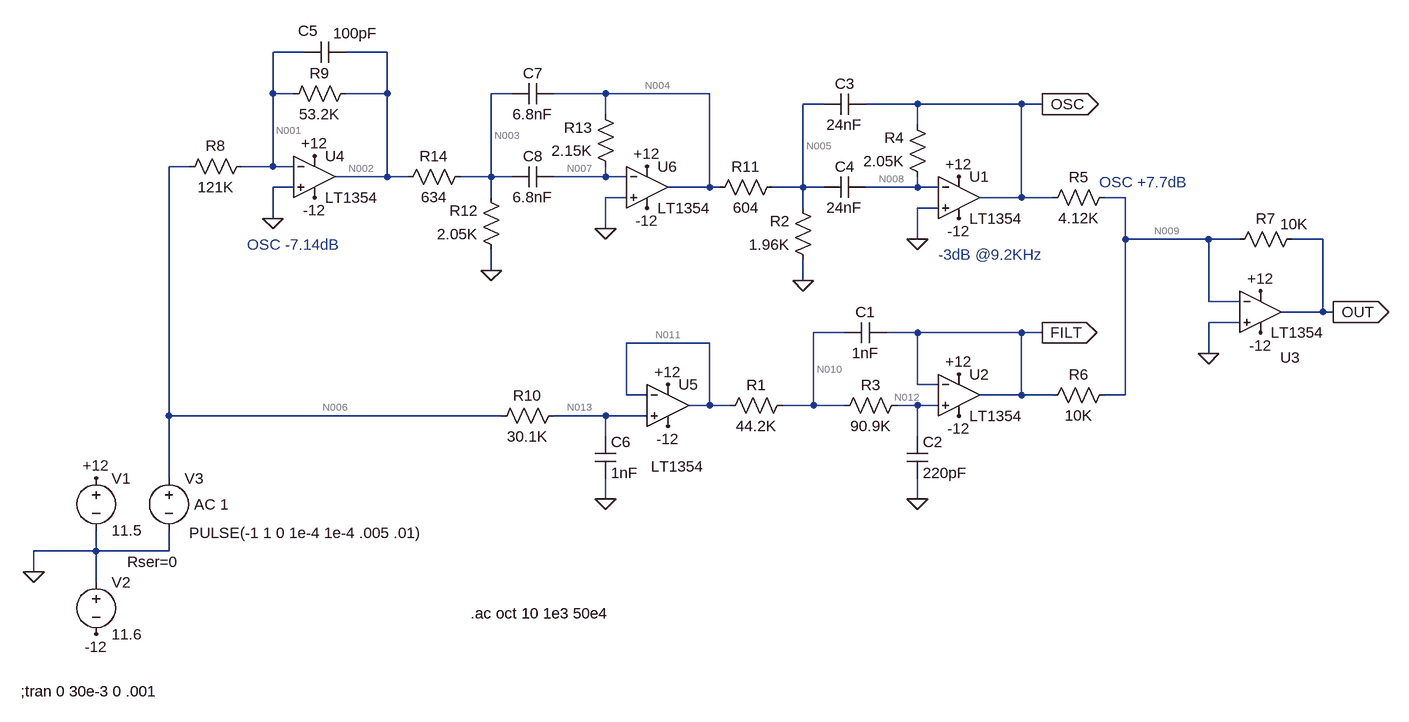
[diagram p0: schematic VCF model.asc]
VCF model.asc, the LTspice schematic file:
Version 4
SHEET 1 1956 680
WIRE -384 -544 -432 -544
WIRE -256 -544 -320 -544
WIRE -432 -480 -432 -544
WIRE -400 -480 -432 -480
WIRE -256 -480 -256 -544
WIRE -256 -480 -320 -480
WIRE -64 -480 -96 -480
WIRE 80 -480 0 -480
WIRE 240 -480 80 -480
WIRE 416 -464 384 -464
WIRE 560 -464 480 -464
WIRE 720 -464 560 -464
WIRE 752 -464 720 -464
WIRE 80 -448 80 -480
WIRE 560 -432 560 -464
WIRE -560 -368 -592 -368
WIRE -432 -368 -432 -480
WIRE -432 -368 -480 -368
WIRE -400 -368 -432 -368
WIRE -256 -352 -256 -480
WIRE -256 -352 -336 -352
WIRE -224 -352 -256 -352
WIRE -96 -352 -96 -480
WIRE -96 -352 -144 -352
WIRE -64 -352 -96 -352
WIRE 80 -352 80 -368
WIRE 80 -352 0 -352
WIRE 112 -352 80 -352
WIRE -400 -336 -432 -336
WIRE 240 -336 240 -480
WIRE 240 -336 176 -336
WIRE 256 -336 240 -336
WIRE 384 -336 384 -464
WIRE 384 -336 336 -336
WIRE 416 -336 384 -336
WIRE 560 -336 560 -352
WIRE 560 -336 480 -336
WIRE 592 -336 560 -336
WIRE -96 -320 -96 -352
WIRE 112 -320 80 -320
WIRE 720 -320 720 -464
WIRE 720 -320 656 -320
WIRE 768 -320 720 -320
WIRE 880 -320 848 -320
WIRE 384 -304 384 -336
WIRE 592 -304 560 -304
WIRE -432 -288 -432 -336
WIRE 80 -272 80 -320
WIRE 560 -256 560 -304
WIRE 880 -256 880 -320
WIRE 1008 -256 880 -256
WIRE 1056 -256 1008 -256
WIRE 1184 -256 1136 -256
WIRE -96 -208 -96 -240
WIRE 384 -192 384 -224
WIRE 1008 -160 1008 -256
WIRE 1056 -160 1008 -160
WIRE 1184 -144 1184 -256
WIRE 1184 -144 1120 -144
WIRE 1200 -144 1184 -144
WIRE 1056 -128 1008 -128
WIRE 448 -112 400 -112
WIRE 560 -112 512 -112
WIRE 720 -112 560 -112
WIRE 752 -112 720 -112
WIRE 240 -96 112 -96
WIRE 1008 -80 1008 -128
WIRE 560 -32 560 -112
WIRE 592 -32 560 -32
WIRE 112 -16 112 -96
WIRE 144 -16 112 -16
WIRE 720 -16 720 -112
WIRE 720 -16 656 -16
WIRE 768 -16 720 -16
WIRE 880 -16 880 -256
WIRE 880 -16 848 -16
WIRE 240 0 240 -96
WIRE 240 0 208 0
WIRE 272 0 240 0
WIRE 400 0 400 -112
WIRE 400 0 352 0
WIRE 448 0 400 0
WIRE 560 0 528 0
WIRE 592 0 560 0
WIRE -592 16 -592 -368
WIRE -80 16 -592 16
WIRE 80 16 0 16
WIRE 144 16 80 16
WIRE 80 48 80 16
WIRE 560 48 560 0
WIRE -592 112 -592 16
WIRE 80 144 80 112
WIRE 560 144 560 112
WIRE -704 224 -704 192
WIRE -704 224 -800 224
WIRE -592 224 -592 192
WIRE -592 224 -704 224
WIRE -800 256 -800 224
WIRE -704 272 -704 224
FLAG -800 256 0
FLAG -704 112 +12
FLAG -704 352 -12
FLAG 560 144 0
FLAG 624 -48 +12
FLAG 624 16 -12
FLAG 384 -192 0
FLAG 624 -352 +12
FLAG 624 -288 -12
FLAG 1008 -80 0
FLAG 1088 -176 +12
FLAG 1088 -112 -12
FLAG -368 -384 +12
FLAG -368 -320 -12
FLAG -432 -288 0
FLAG 752 -464 OSC
IOPIN 752 -464 Out
FLAG 752 -112 FILT
IOPIN 752 -112 Out
FLAG 1200 -144 OUT
IOPIN 1200 -144 Out
FLAG 176 -32 +12
FLAG 176 32 -12
FLAG 80 144 0
FLAG 560 -256 0
FLAG -96 -208 0
FLAG 144 -368 +12
FLAG 144 -304 -12
FLAG 80 -272 0
SYMBOL voltage -704 96 R0
WINDOW 123 0 0 Left 0
WINDOW 39 0 0 Left 0
SYMATTR InstName V1
SYMATTR Value 11.5
SYMBOL voltage -704 256 R0
WINDOW 123 0 0 Left 0
WINDOW 39 0 0 Left 0
SYMATTR InstName V2
SYMATTR Value 11.6
SYMBOL res 368 -16 R90
WINDOW 0 0 56 VBottom 2
WINDOW 3 32 56 VTop 2
SYMATTR InstName R1
SYMATTR Value 44.2K
SYMBOL voltage -592 96 R0
WINDOW 3 31 100 Left 2
WINDOW 123 39 56 Left 2
WINDOW 39 -64 145 Left 2
SYMATTR Value PULSE(-1 1 0 1e-4 1e-4 .005 .01)
SYMATTR Value2 AC 1
SYMATTR SpiceLine Rser=0
SYMATTR InstName V3
SYMBOL cap 512 -128 R90
WINDOW 0 0 32 VBottom 2
WINDOW 3 32 32 VTop 2
SYMATTR InstName C1
SYMATTR Value 1nF
SYMBOL OpAmps\\LT1354 624 -80 R0
SYMATTR InstName U2
SYMBOL res 544 -16 R90
WINDOW 0 0 56 VBottom 2
WINDOW 3 32 56 VTop 2
SYMATTR InstName R3
SYMATTR Value 90.9K
SYMBOL cap 544 48 R0
SYMATTR InstName C2
SYMATTR Value 220pF
SYMBOL res 400 -208 R180
WINDOW 0 36 76 Left 2
WINDOW 3 36 40 Left 2
SYMATTR InstName R2
SYMATTR Value 1.96K
SYMBOL cap 480 -480 R90
WINDOW 0 0 32 VBottom 2
WINDOW 3 32 32 VTop 2
SYMATTR InstName C3
SYMATTR Value 24nF
SYMBOL OpAmps\\LT1354 624 -384 R0
SYMATTR InstName U1
SYMBOL res 576 -336 R180
WINDOW 0 36 76 Left 2
WINDOW 3 36 40 Left 2
SYMATTR InstName R4
SYMATTR Value 2.05K
SYMBOL cap 480 -352 R90
WINDOW 0 0 32 VBottom 2
WINDOW 3 32 32 VTop 2
SYMATTR InstName C4
SYMATTR Value 24nF
SYMBOL OpAmps\\LT1354 1088 -208 R0
WINDOW 0 30 134 Left 2
SYMATTR InstName U3
SYMBOL res 864 -336 R90
WINDOW 0 0 56 VBottom 2
WINDOW 3 32 56 VTop 2
SYMATTR InstName R5
SYMATTR Value 4.12K
SYMBOL res 864 -32 R90
WINDOW 0 0 56 VBottom 2
WINDOW 3 32 56 VTop 2
SYMATTR InstName R6
SYMATTR Value 10K
SYMBOL res 1152 -272 R90
WINDOW 0 0 56 VBottom 2
WINDOW 3 -23 12 VTop 2
SYMATTR InstName R7
SYMATTR Value 10K
SYMBOL OpAmps\\LT1354 -368 -416 R0
SYMATTR InstName U4
SYMBOL res -464 -384 R90
WINDOW 0 0 56 VBottom 2
WINDOW 3 32 56 VTop 2
SYMATTR InstName R8
SYMATTR Value 121K
SYMBOL res -304 -496 R90
WINDOW 0 0 56 VBottom 2
WINDOW 3 32 56 VTop 2
SYMATTR InstName R9
SYMATTR Value 53.2K
SYMBOL cap -320 -560 R90
WINDOW 0 -1 58 VBottom 2
WINDOW 3 -29 -15 VTop 2
SYMATTR InstName C5
SYMATTR Value 100pF
SYMBOL OpAmps\\LT1354 176 -64 R0
WINDOW 3 -26 158 Left 2
SYMATTR InstName U5
SYMBOL res 16 0 R90
WINDOW 0 0 56 VBottom 2
WINDOW 3 32 56 VTop 2
SYMATTR InstName R10
SYMATTR Value 30.1K
SYMBOL cap 64 48 R0
SYMATTR InstName C6
SYMATTR Value 1nF
SYMBOL res 352 -352 R90
WINDOW 0 0 56 VBottom 2
WINDOW 3 32 56 VTop 2
SYMATTR InstName R11
SYMATTR Value 604
SYMBOL res -80 -224 R180
WINDOW 0 36 76 Left 2
WINDOW 3 36 40 Left 2
SYMATTR InstName R12
SYMATTR Value 2.05K
SYMBOL cap 0 -496 R90
WINDOW 0 0 32 VBottom 2
WINDOW 3 32 32 VTop 2
SYMATTR InstName C7
SYMATTR Value 6.8nF
SYMBOL OpAmps\\LT1354 144 -400 R0
SYMATTR InstName U6
SYMBOL res 96 -352 R180
WINDOW 0 36 76 Left 2
WINDOW 3 36 40 Left 2
SYMATTR InstName R13
SYMATTR Value 2.15K
SYMBOL cap 0 -368 R90
WINDOW 0 0 32 VBottom 2
WINDOW 3 32 32 VTop 2
SYMATTR InstName C8
SYMATTR Value 6.8nF
SYMBOL res -128 -368 R90
WINDOW 0 0 56 VBottom 2
WINDOW 3 32 56 VTop 2
SYMATTR InstName R14
SYMATTR Value 634
TEXT -128 320 Left 2 !.ac oct 10 1e3 50e4
TEXT 592 -232 Left 2 ;-3dB @9.2KHz
TEXT -472 -248 Left 2 ;OSC -7.14dB
TEXT 840 -344 Left 2 ;OSC +7.7dB
TEXT -820 440 Left 2 !;tran 0 30e-3 0 .001

The netlist it stands for:
* VCF model.asc
V1 +12 0 11.5
V2 0 -12 11.6
R1 N010 N011 44.2K
V3 N006 0 PULSE(-1 1 0 1e-4 1e-4 .005 .01) AC 1 Rser=0
C1 FILT N010 1nF
XU2 N012 FILT +12 -12 FILT LT1354  ; pins In+ In- V+ V- OUT
R3 N012 N010 90.9K
C2 N012 0 220pF
R2 0 N005 1.96K
C3 OSC N005 24nF
XU1 0 N008 +12 -12 OSC LT1354  ; pins In+ In- V+ V- OUT
R4 N008 OSC 2.05K
C4 N008 N005 24nF
XU3 0 N009 +12 -12 OUT LT1354  ; pins In+ In- V+ V- OUT
R5 N009 OSC 4.12K
R6 N009 FILT 10K
R7 OUT N009 10K
XU4 0 N001 +12 -12 N002 LT1354  ; pins In+ In- V+ V- OUT
R8 N001 N006 121K
R9 N002 N001 53.2K
C5 N002 N001 100pF
XU5 N013 N011 +12 -12 N011 LT1354  ; pins In+ In- V+ V- OUT
R10 N013 N006 30.1K
C6 N013 0 1nF
R11 N005 N004 604
R12 0 N003 2.05K
C7 N004 N003 6.8nF
XU6 0 N007 +12 -12 N004 LT1354  ; pins In+ In- V+ V- OUT
R13 N007 N004 2.15K
C8 N007 N003 6.8nF
R14 N003 N002 634
.ac oct 10 1e3 50e4
* -3dB @9.2KHz
* OSC -7.14dB
* OSC +7.7dB
;tran 0 30e-3 0 .001
.backanno
.end

* Results of the author's LTspice run, read from the files saved beside the schematic
* Operating Point, zero values left out:
*   V(+12) = 11.5 V
*   V(-12) = -11.6 V
*   V(n010) = -1.006 V
*   V(n011) = -1.002 V
*   V(n006) = -1 V
*   V(filt) = -1.012 V
*   V(n012) = -1.012 V
*   V(n005) = 131.9 µV
*   V(osc) = 164.5 µV
*   V(n008) = -1.391 µV
*   V(n009) = -29.59 µV
*   V(out) = 1.013 V
*   V(n001) = -13.88 µV
*   V(n002) = 444 mV
*   V(n013) = -1.002 V
*   V(n004) = 172.6 µV
*   V(n003) = 339.1 mV
*   V(n007) = -1.391 µV
*   I(R14) = -165.4 µA
*   I(R13) = -80.91 nA
*   I(R12) = -165.4 µA
*   I(R11) = -67.31 nA
*   I(R10) = -74.65 nA
*   I(R9) = 8.345 µA
*   I(R8) = 8.264 µA
*   I(R7) = 101.3 µA
*   I(R6) = 101.2 µA
*   I(R5) = -47.1 nA
*   I(R4) = -80.91 nA
*   I(R2) = -67.31 nA
*   I(R3) = -74.58 nA
*   I(R1) = -74.58 nA
*   I(V3) = 8.19 µA
*   I(V2) = -5.882 mA
*   I(V1) = -6.055 mA
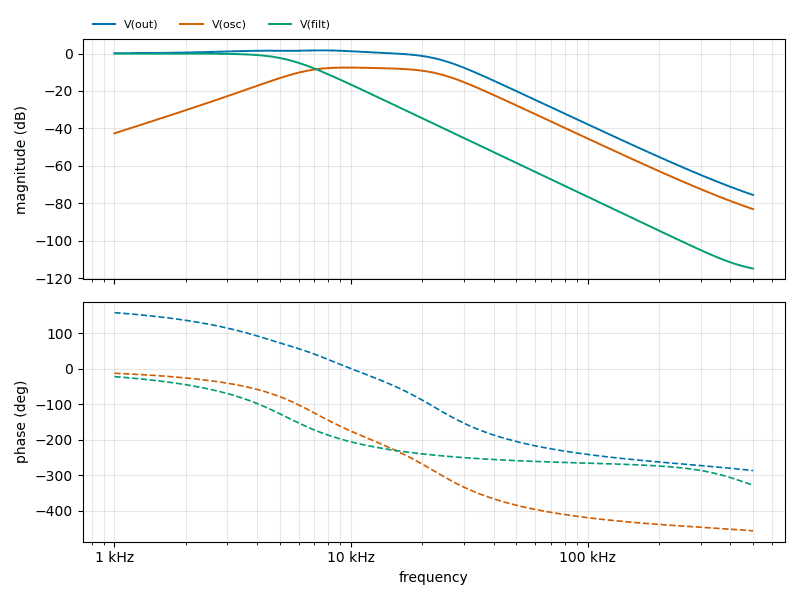
[diagram p1: AC Analysis of VCF model.asc, plotted from the saved traces]
* AC Analysis, 1 run:
*   V(out): 0.14 dB at 1 kHz, -75.59 dB at 500 kHz, peak 1.70 dB at 7.464 kHz, 3 dB below the peak at 19.97 kHz
*   V(osc): -42.64 dB at 1 kHz, -83.17 dB at 500 kHz, peak -7.51 dB at 9.849 kHz, 3 dB below the peak at 5.873 kHz and 22.87 kHz
*   V(filt): -0.01 dB at 1 kHz, -114.90 dB at 500 kHz, peak -0.01 dB at 1 kHz, 3 dB below the peak at 5.281 kHz